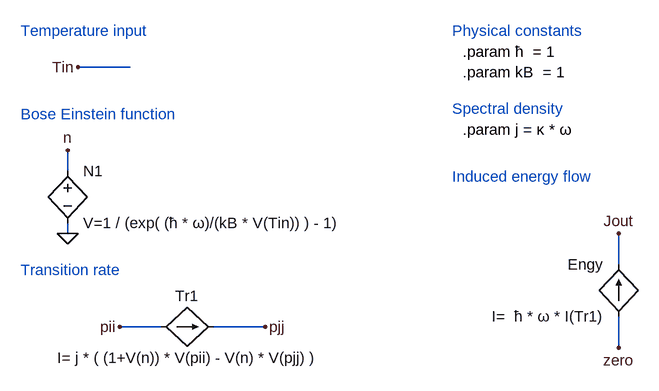
[diagram p0: schematic transition_rate.asc]
transition_rate.asc, the LTspice schematic file:
Version 4
SHEET 1 880 680
WIRE -64 -96 -144 -96
WIRE -160 64 -160 32
WIRE -160 160 -160 144
WIRE 688 208 688 160
WIRE -16 304 -80 304
WIRE 144 304 64 304
WIRE 688 336 688 288
FLAG -160 160 0
FLAG -144 -96 Tin
FLAG -160 32 n
FLAG -80 304 pii
FLAG 144 304 pjj
FLAG 688 160 Jout
FLAG 688 336 zero
SYMBOL bv -160 48 R0
SYMATTR InstName N1
SYMATTR Value V=1 / (exp( (ħ * ω)/(kB * V(Tin)) ) - 1)
SYMBOL bi -16 304 R270
WINDOW 0 32 40 VTop 2
WINDOW 3 -32 40 VBottom 2
SYMATTR InstName Tr1
SYMATTR Value I= j * ( (1+V(n)) * V(pii) - V(n) * V(pjj) )
SYMBOL bi 688 288 R180
WINDOW 0 24 80 Left 2
WINDOW 3 24 0 Left 2
SYMATTR InstName Engy
SYMATTR Value I=  ħ * ω * I(Tr1)
TEXT -232 -24 Left 2 ;Bose Einstein function
TEXT -232 -152 Left 2 ;Temperature input
TEXT -232 216 Left 2 ;Transition rate
TEXT 432 -152 Left 2 ;Physical constants
TEXT 448 -120 Left 2 !.param ħ  = 1\n.param kB  = 1
TEXT 432 -32 Left 2 ;Spectral density
TEXT 448 0 Left 2 !.param j = κ * ω
TEXT 432 72 Left 2 ;Induced energy flow

The netlist it stands for:
* transition_rate.asc
B§N1 n 0 V=1 / (exp( (ħ * ω)/(kB * V(Tin)) ) - 1)
B§Tr1 pii pjj I= j * ( (1+V(n)) * V(pii) - V(n) * V(pjj) )
B§Engy zero Jout I=  ħ * ω * I(Tr1)
* Bose Einstein function
* Temperature input
* Transition rate
* Physical constants
.param ħ  = 1
.param kB  = 1
* Spectral density
.param j = κ * ω
* Induced energy flow
.backanno
.end